# EasyEDA schematic 4KB_SRAM_SCH_EASYEDA.json
TITLE: 4KB SRAM Module SCH; REV: 1.0; Date: 2023-05-21; Sheet: 1/1; Drawn By: UnethicalBear; Company: github.com/UnethicalBear
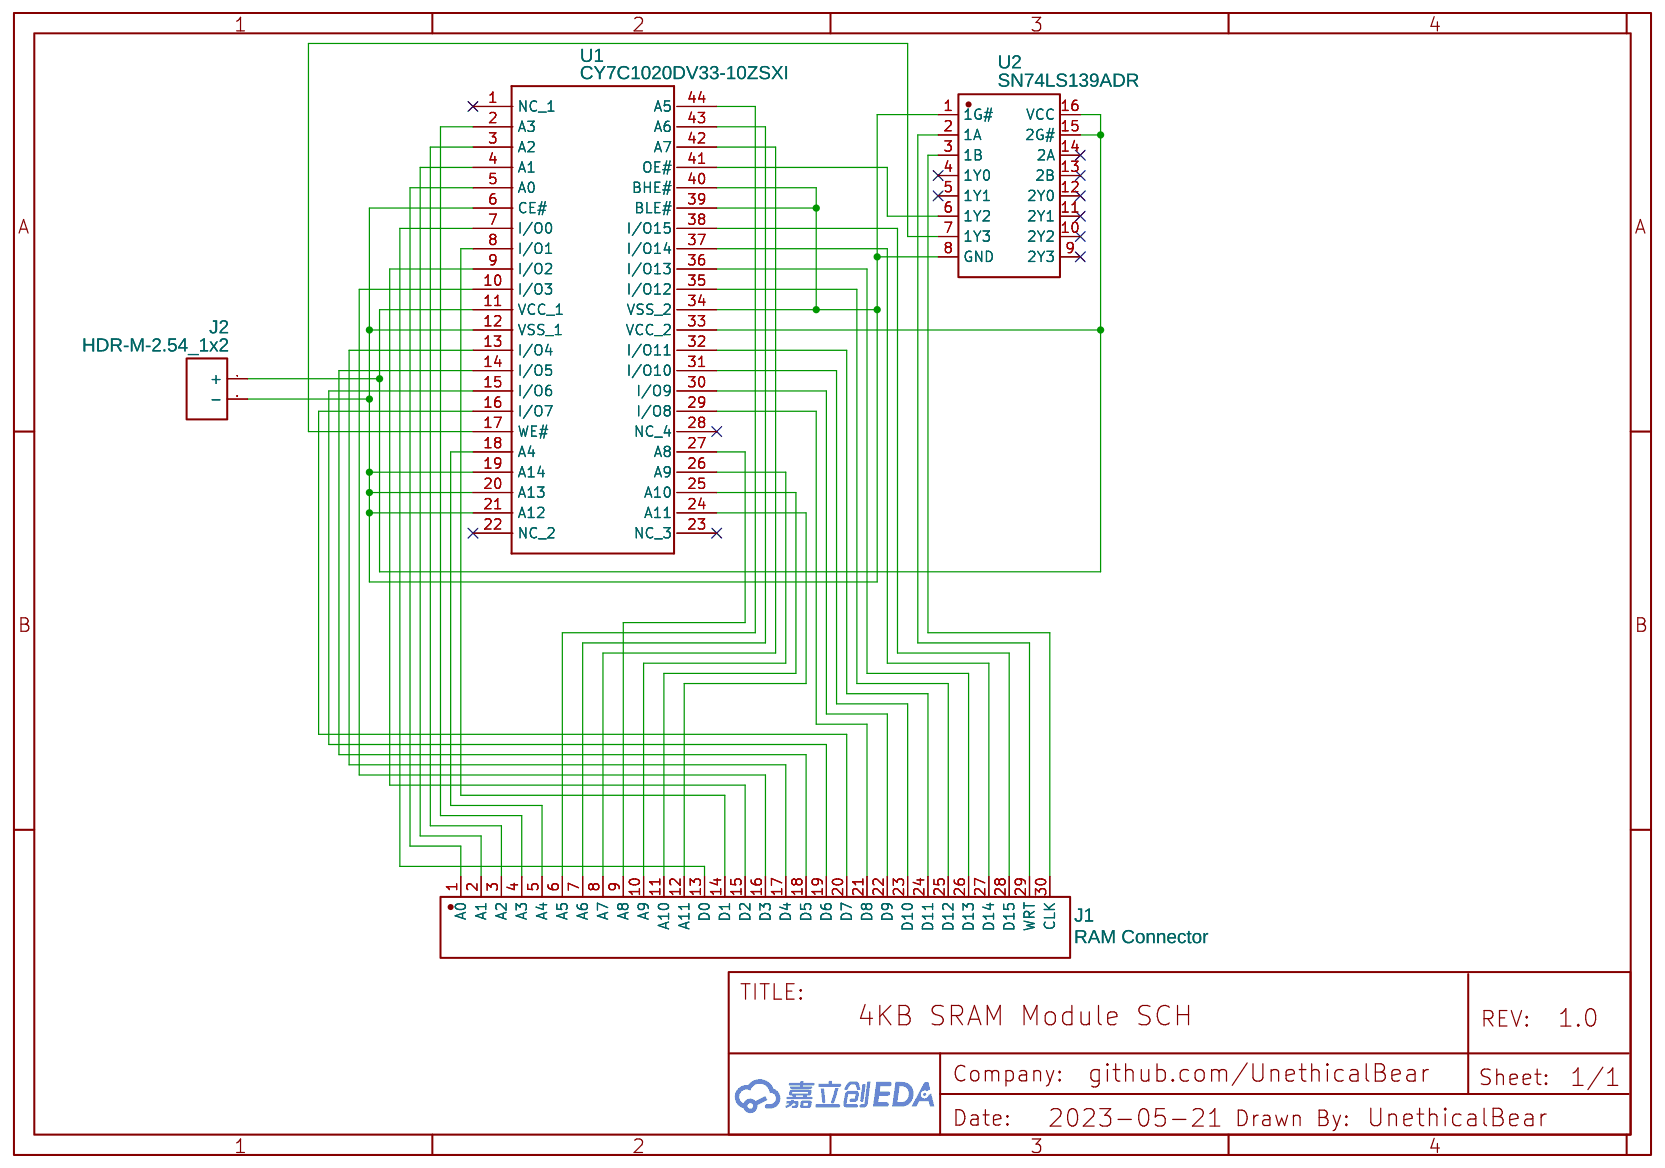
[diagram p0: schematic sheet]

## Parts
J1  RAM Connector  [30-SIP-WITH-NOTCH]
J2  HDR-M-2.54_1x2  [HDR-M-2.54_1X2]
U1  CY7C1020DV33-10ZSXI  [SOP80P1184X119-44N]
U2  SN74LS139ADR  [SOIC-16_L9.9-W3.9-P1.27-LS6.0-BL]

## Library data of the parts
J1 = R.C.
J2 = HDR-M-2.54_1x2: Supplier Part: C124375; Supplier: LCSC; Contributor: LCEDA_Lib
U1 = CY7C1020DV33-10ZSXI: Contributor: shawleonm
U2 = SN74LS139ADR: Supplier: LCSC; Supplier Part: C7738; Manufacturer: TI(德州仪器); Contributor: LCSC; JLCPCB Part Class: Extended Part

## Nets
Net-(J1-1): J1.1(A0) U1.5(A0)
Net-(J1-2): J1.2(A1) U1.4(A1)
Net-(J1-3): J1.3(A2) U1.3(A2)
Net-(J1-4): J1.4(A3) U1.2(A3)
Net-(J1-5): J1.5(A4) U1.18(A4)
Net-(J1-6): J1.6(A5) U1.44(A5)
Net-(J1-7): J1.7(A6) U1.43(A6)
Net-(J1-8): J1.8(A7) U1.42(A7)
Net-(J1-9): J1.9(A8) U1.27(A8)
Net-(J1-10): J1.10(A9) U1.26(A9)
Net-(J1-11): J1.11(A10) U1.25(A10)
Net-(J1-12): J1.12(A11) U1.24(A11)
Net-(J1-13): J1.13(D0) U1.7(I/O0)
Net-(J1-14): J1.14(D1) U1.8(I/O1)
Net-(J1-15): J1.15(D2) U1.9(I/O2)
Net-(J1-16): J1.16(D3) U1.10(I/O3)
Net-(J1-17): J1.17(D4) U1.13(I/O4)
Net-(J1-18): J1.18(D5) U1.14(I/O5)
Net-(J1-19): J1.19(D6) U1.15(I/O6)
Net-(J1-20): J1.20(D7) U1.16(I/O7)
Net-(J1-21): J1.21(D8) U1.29(I/O8)
Net-(J1-22): J1.22(D9) U1.30(I/O9)
Net-(J1-23): J1.23(D10) U1.31(I/O10)
Net-(J1-24): J1.24(D11) U1.32(I/O11)
Net-(J1-25): J1.25(D12) U1.35(I/O12)
Net-(J1-26): J1.26(D13) U1.36(I/O13)
Net-(J1-27): J1.27(D14) U1.37(I/O14)
Net-(J1-28): J1.28(D15) U1.38(I/O15)
Net-(J1-29): J1.29(WRT) U2.2(1A)
Net-(J1-30): J1.30(CLK) U2.3(1B)
Net-(J2-1): J2.1(+) U1.11(VCC_1) U1.33(VCC_2) U2.15(2G#) U2.16(VCC)
Net-(J2-2): J2.2(-) U1.6(CE#) U1.12(VSS_1) U1.19(A14) U1.20(A13) U1.21(A12) U1.34(VSS_2) U1.39(BLE#) U1.40(BHE#) U2.1(1G#) U2.8(GND)
Net-(U1-17): U1.17(WE#) U2.7(1Y3)
Net-(U1-41): U1.41(OE#) U2.6(1Y2)

Not connected (* = marked no-connect by the designer): U1 1(NC)* 22(NC_2)* 23(NC_3)* 28(NC_4)*; U2 4(1Y0)* 5(1Y1)* 9(2Y3)* 10(2Y2)* 11(2Y1)* 12(2Y0)* 13(2B)* 14(2A)*
